# EasyEDA Pro project wifi-power.eprj

# Schematic Schematic

## Sheets
1 P1: Board Name: Board; Create Date: 2025-02-23; Page Name: P1; Project Name: wifi-power; Schematic Name: Schematic; Update Date: 2025-02-23; Company: https://github.com/NimaLTD/wifi-power; Page Size: A4; Version: V1.0
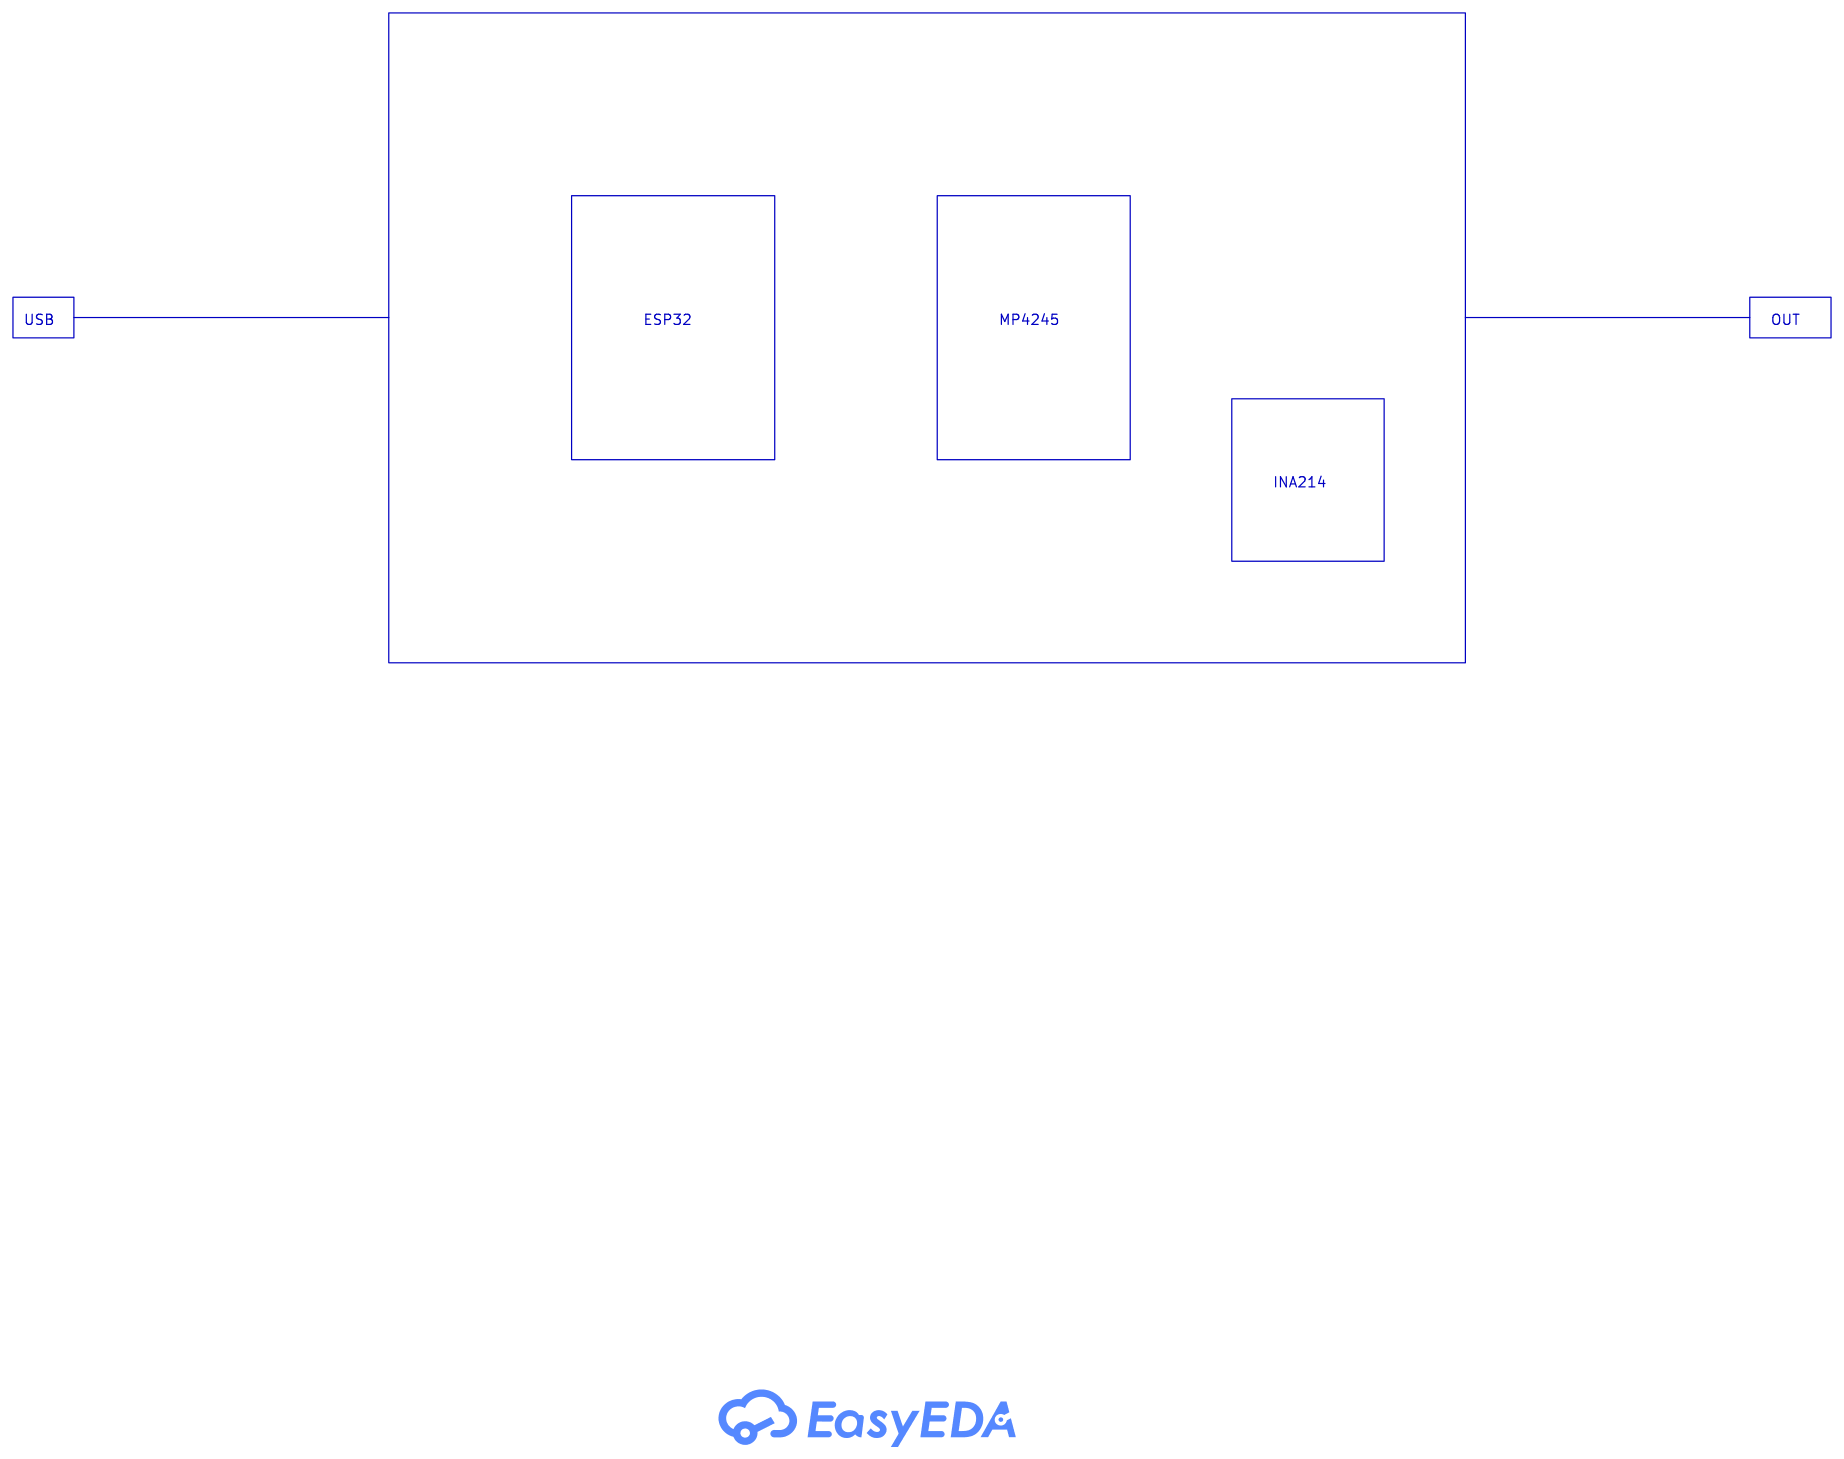
[diagram p0: P1]
2 USB: Page Name: USB; Update Date: 2025-02-25; Company: EasyEDA.com
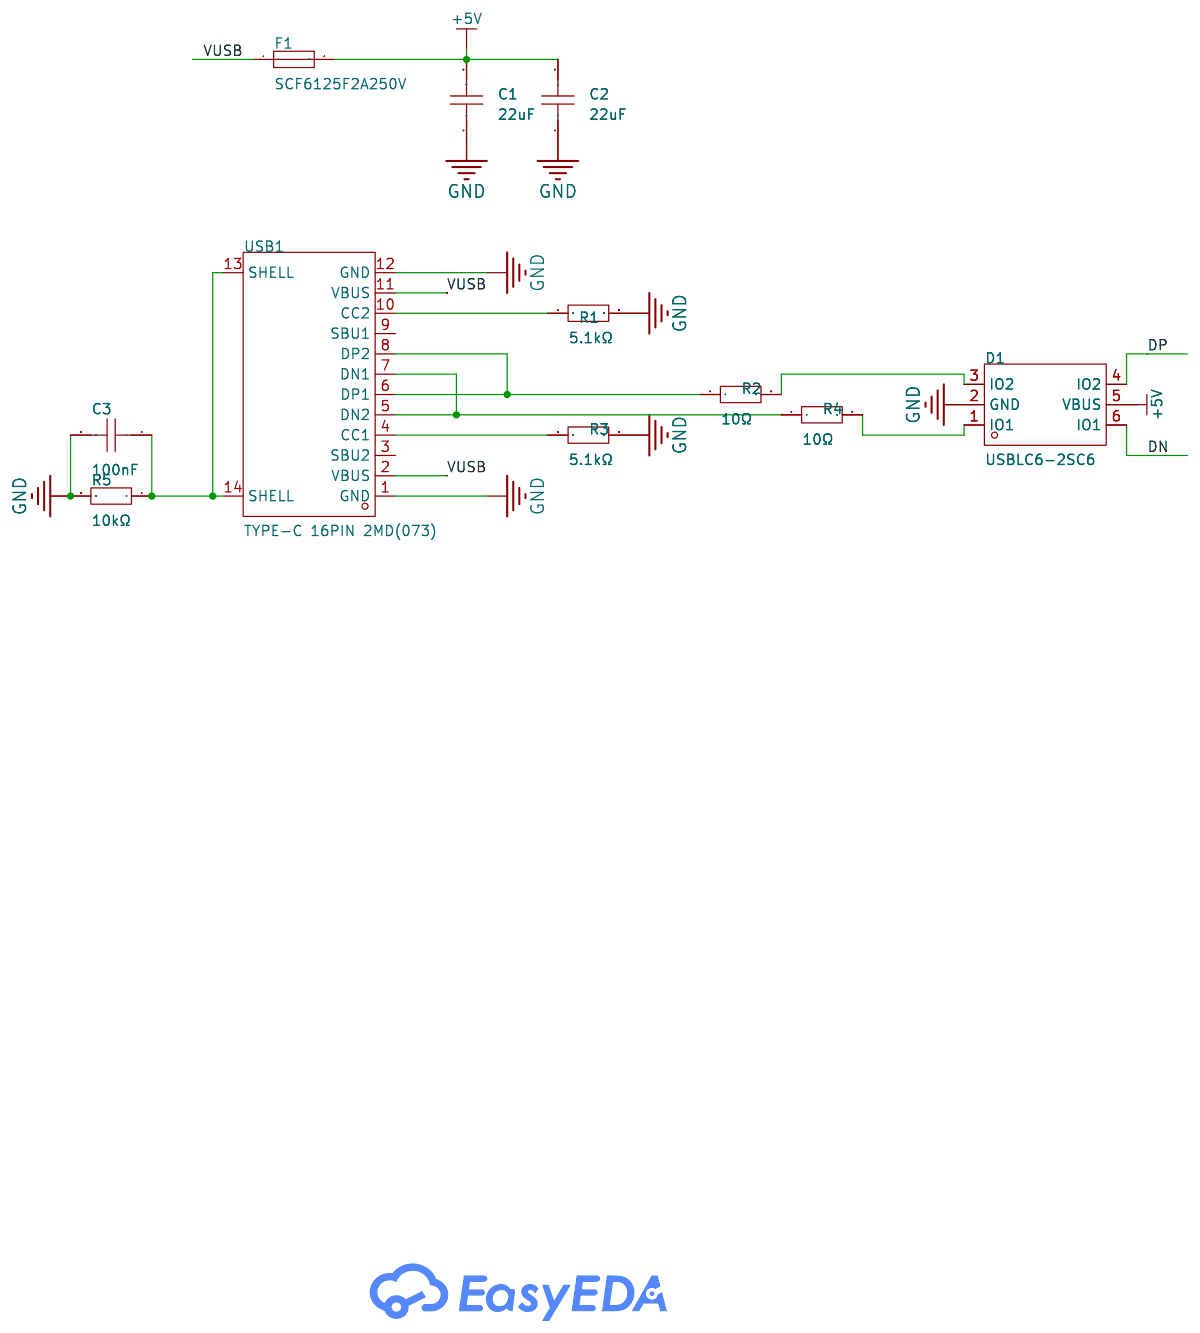
[diagram p1: USB]
3 REG: Page Name: REG; Company: EasyEDA.com
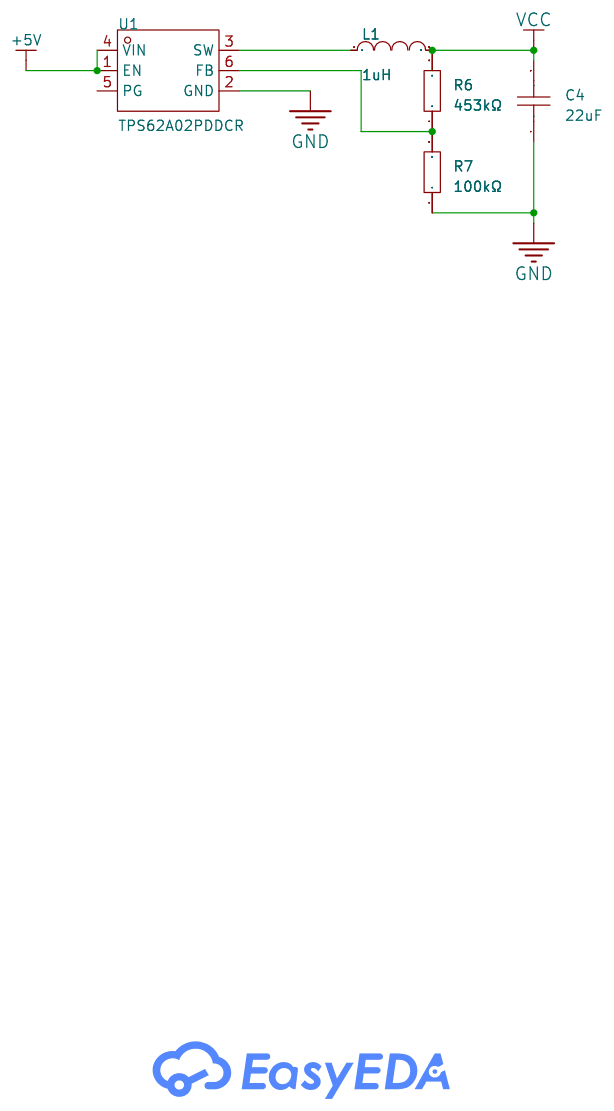
[diagram p2: REG]
4 ESP32: Page Name: ESP32; Update Date: 2025-02-25; Company: EasyEDA.com
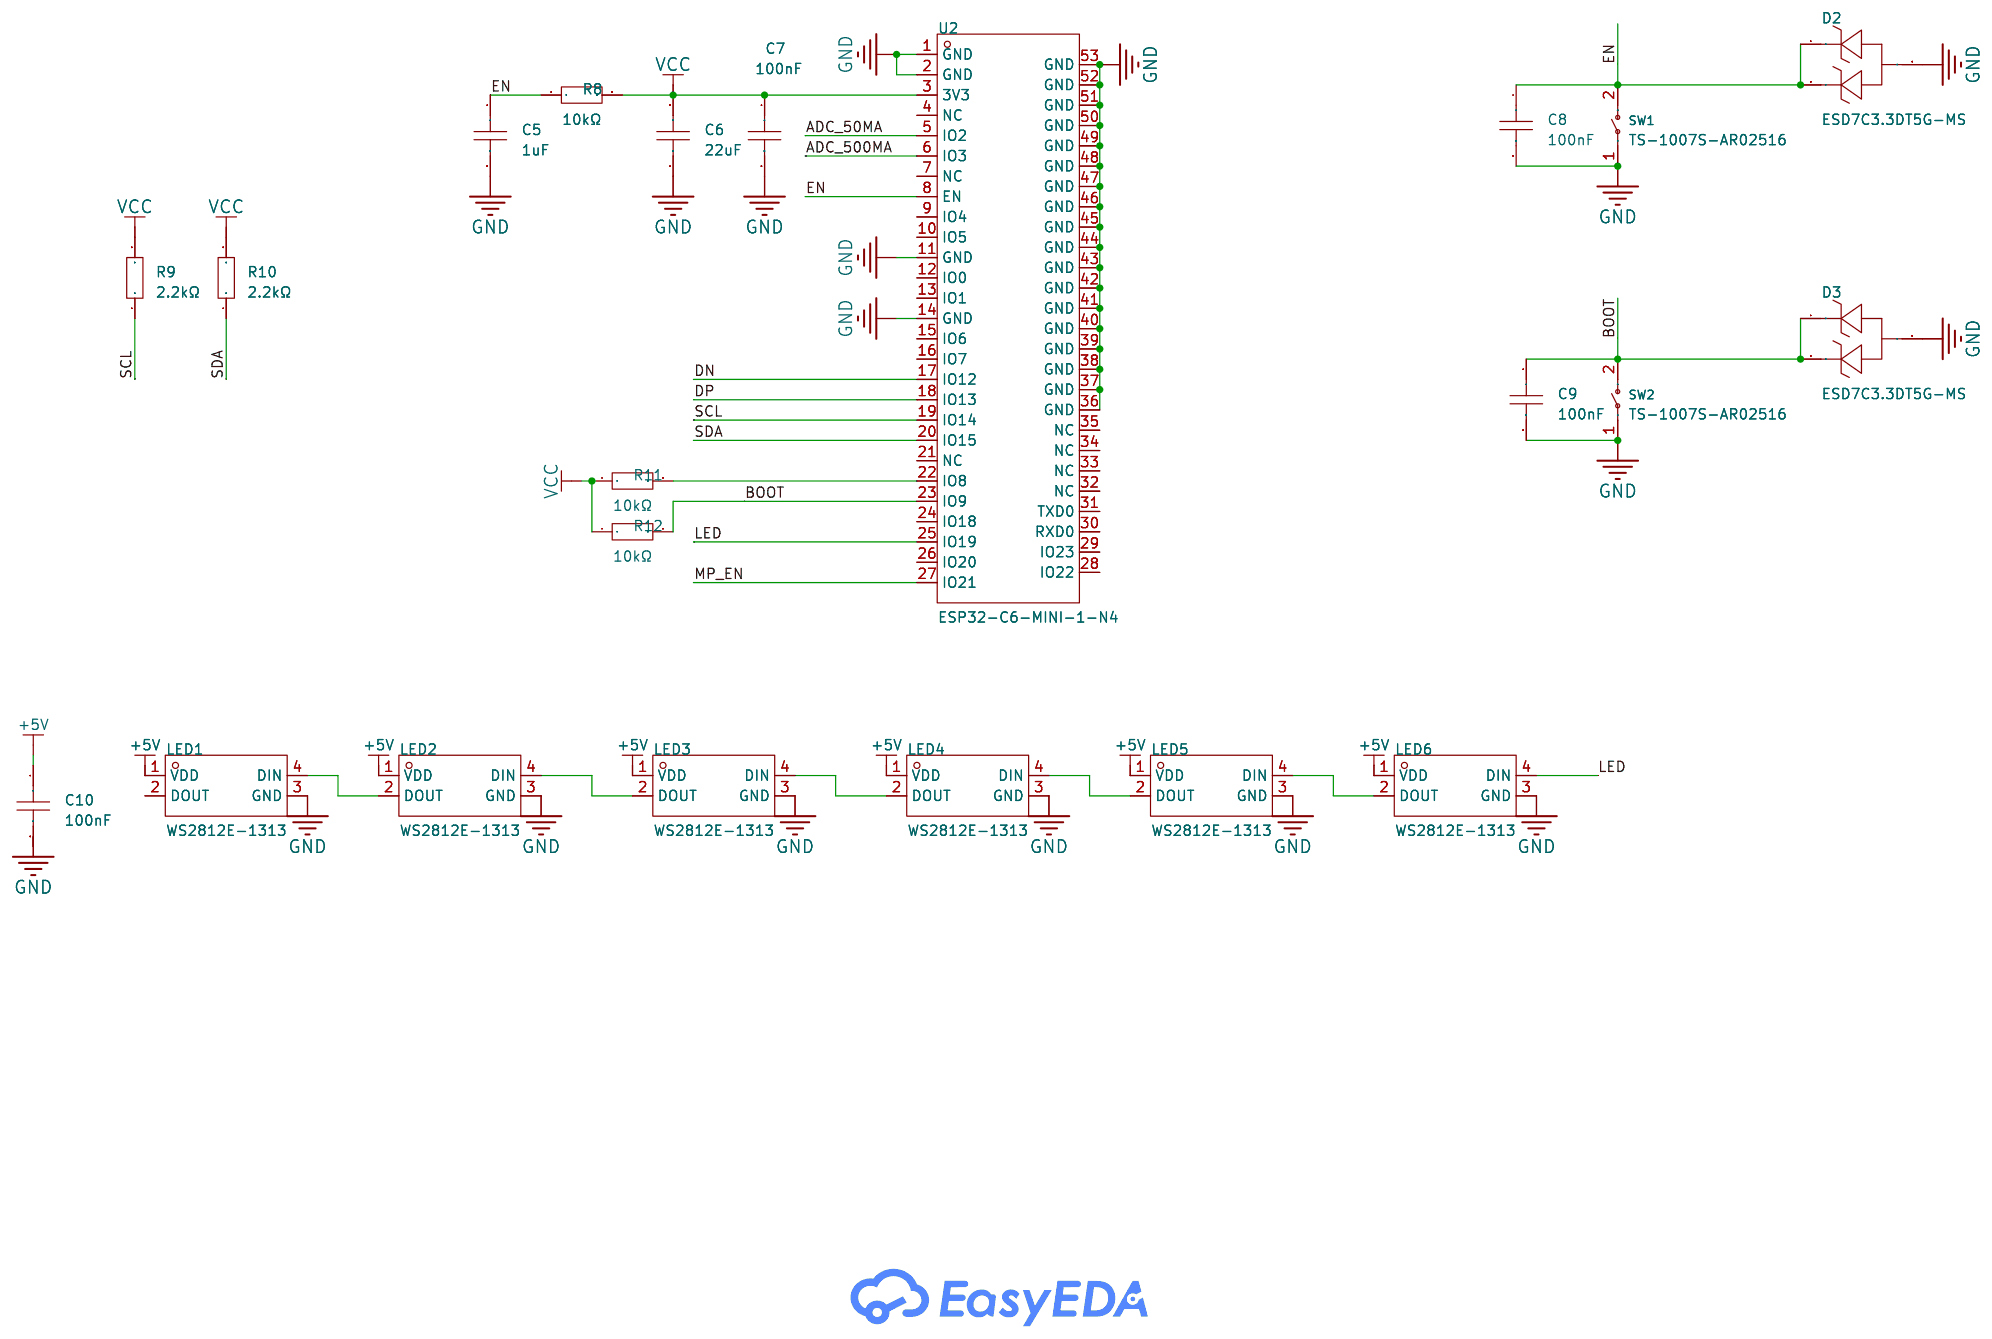
[diagram p3: ESP32]
5 MP4245: Page Name: MP4245; Update Date: 2025-02-25; Company: EasyEDA.com
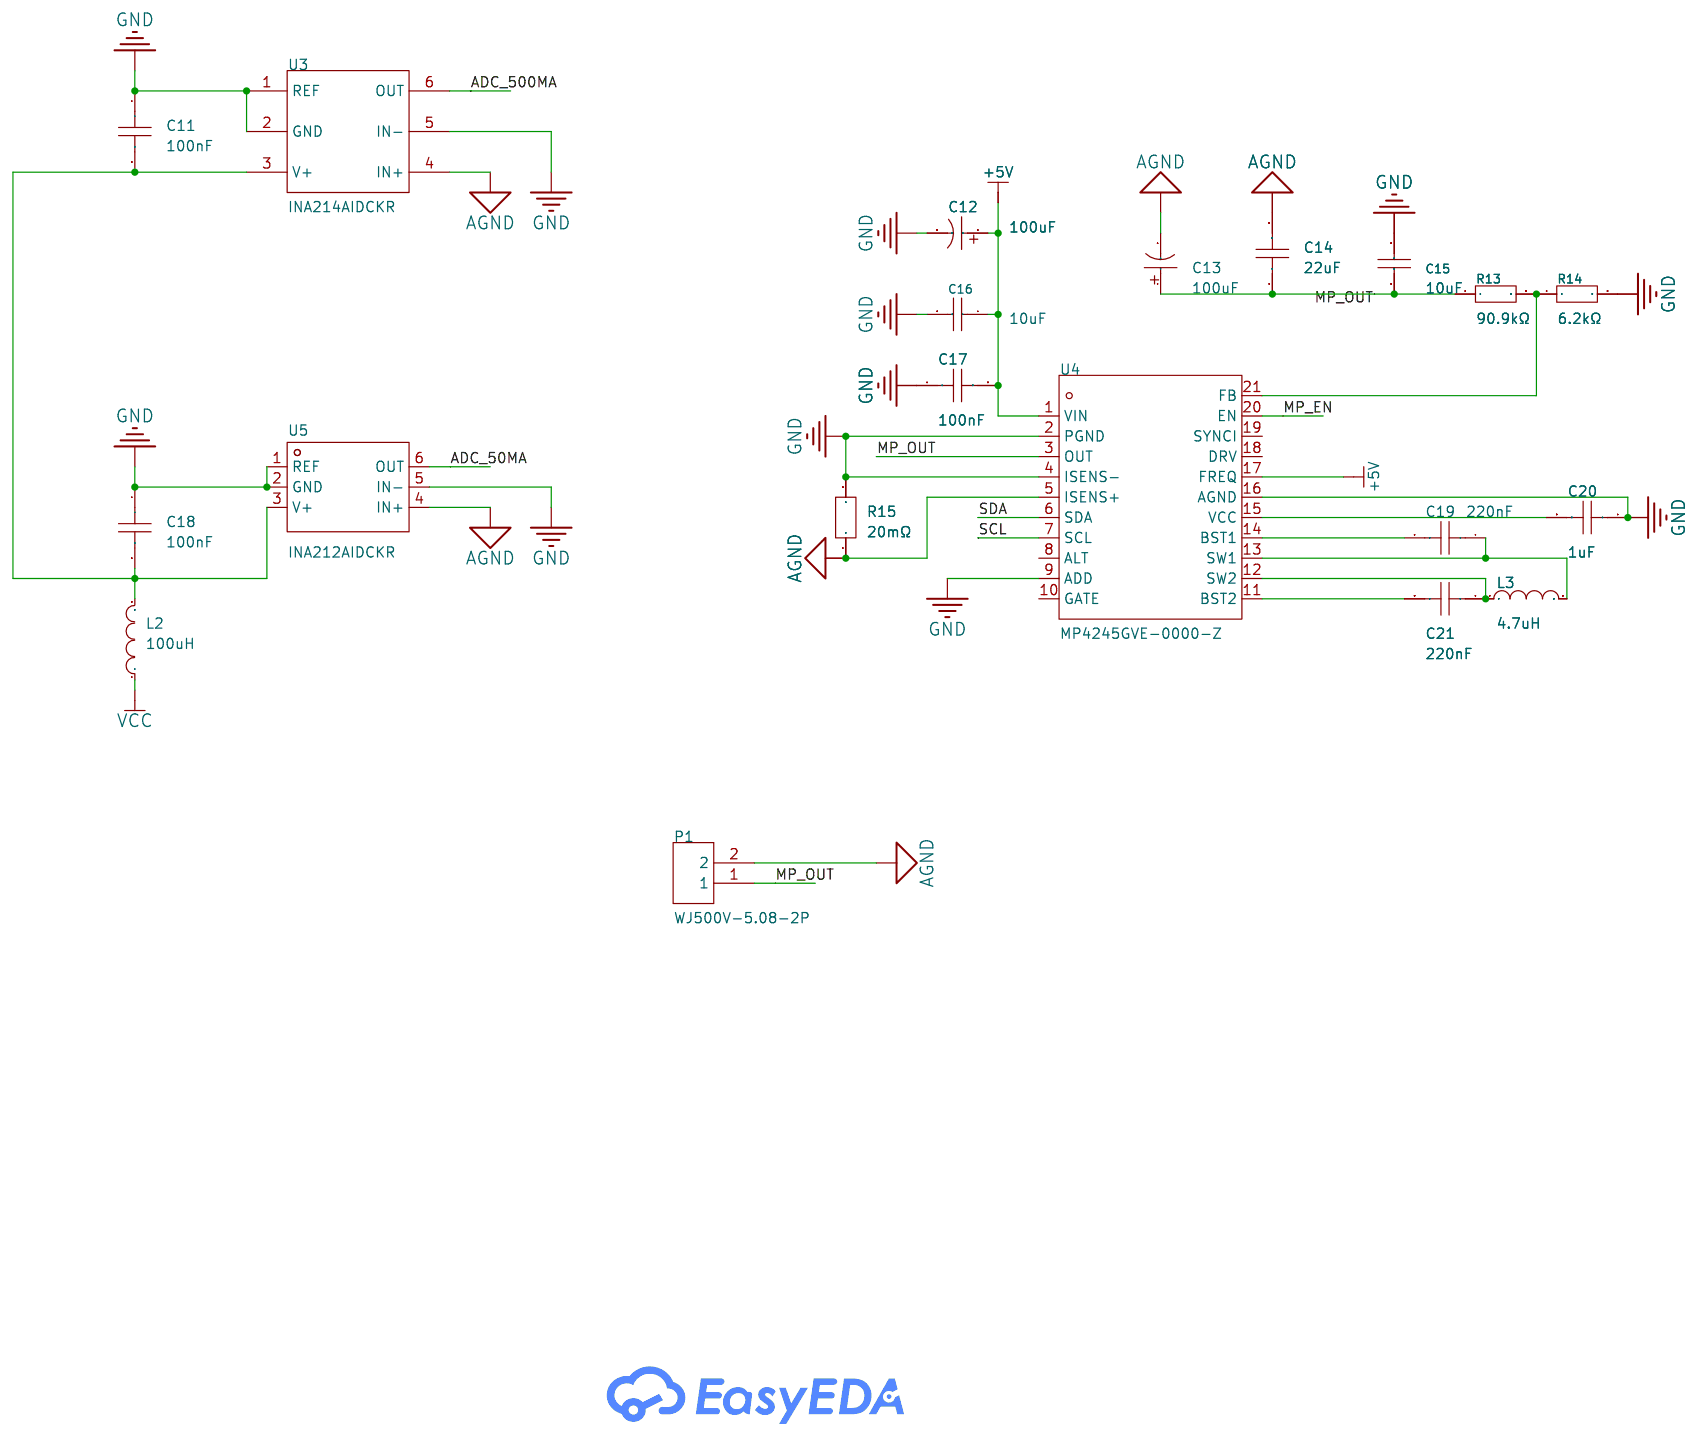
[diagram p4: MP4245]

## Parts
sheet ESP32
C5  1uF  [C0603]
C6  22uF  [C0805]
C7  100nF  [C0603]
C8  100nF  [C0603]
C9  100nF  [C0603]
C10  100nF  [C0603]
D2  ESD7C3.3DT5G-MS  [SOT-723-3_L1.2-W0.8-P0.80-LS1.2-BR]
D3  ESD7C3.3DT5G-MS  [SOT-723-3_L1.2-W0.8-P0.80-LS1.2-BR]
LED1  WS2812E-1313  [LED-SMD_4P-L1.3-W1.3-P0.80_WS2812E-1313]
LED2  WS2812E-1313  [LED-SMD_4P-L1.3-W1.3-P0.80_WS2812E-1313]
LED3  WS2812E-1313  [LED-SMD_4P-L1.3-W1.3-P0.80_WS2812E-1313]
LED4  WS2812E-1313  [LED-SMD_4P-L1.3-W1.3-P0.80_WS2812E-1313]
LED5  WS2812E-1313  [LED-SMD_4P-L1.3-W1.3-P0.80_WS2812E-1313]
LED6  WS2812E-1313  [LED-SMD_4P-L1.3-W1.3-P0.80_WS2812E-1313]
R8  10kΩ  [R0603]
R9  2.2kΩ  [R0603]
R10  2.2kΩ  [R0603]
R11  10kΩ  [R0603]
R12  10kΩ  [R0603]
SW1  TS-1007S-AR02516  [SW-SMD_L6.1-W3.6-LS7.9]
SW2  TS-1007S-AR02516  [SW-SMD_L6.1-W3.6-LS7.9]
U2  ESP32-C6-MINI-1-N4  [WIFIM-SMD_61P-L16.6-W13.2-P0.80-ESP32-C6-MINI-1-N4]
sheet MP4245
C11  100nF  [C0603]
C12  100uF  [CAP-SMD_BD6.3-L6.6-W6.6-FD]
C13  100uF  [CAP-SMD_BD6.3-L6.6-W6.6-FD]
C14  22uF  [C1206]
C15  10uF  [C0805]
C16  10uF  [C0805]
C17  100nF  [C0603]
C18  100nF  [C0603]
C19  220nF  [C0603]
C20  1uF  [C0603]
C21  220nF  [C0603]
L2  100uH  [L0805]
L3  4.7uH  [IND-SMD_L5.7-W5.2_CYA0530]
P1  WJ500V-5.08-2P  [CONN-TH_2P-P5.00_WJ500V-5.08-2P]
R13  90.9kΩ  [R0603]
R14  6.2kΩ  [R0603]
R15  20mΩ  [R0805]
U3  INA214AIDCKR  [SC-70-6_L2.2-W1.3-P0.65-LS2.2-BR]
U4  MP4245GVE-0000-Z  [QFN-21_L5.0-W4.0_MP4245GVE]
U5  INA212AIDCKR  [SOT-363_L2.0-W1.3-P0.65-LS2.1-BL]
sheet REG
C4  22uF  [C0805]
L1  1uH  [L0806]
R6  453kΩ  [R0603]
R7  100kΩ  [R0603]
U1  TPS62A02PDDCR  [SOT-23-6_L2.9-W1.6-P0.95-LS2.9-BL]
sheet USB
C1  22uF  [C0805]
C2  22uF  [C0805]
C3  100nF  [C0603]
D1  USBLC6-2SC6  [SOT-23-6_L2.9-W1.6-P0.95-LS2.8-BL]
F1  SCF6125F2A250V  [FUSE-SMD_L6.3-W2.7]
R1  5.1kΩ  [R0603]
R2  10Ω  [R0603]
R3  5.1kΩ  [R0603]
R4  10Ω  [R0603]
R5  10kΩ  [R0603]
USB1  TYPE-C 16PIN 2MD(073)  [USB-C-SMD_TYPE-C-6PIN-2MD-073]

## Library data of the parts
C5 = 0603F105Z100CT: Capacitance: Tolerance:-20%~+80% Tolerance:-20%~+80% Voltage Rated: Temperature Coefficient:; LCSC Part Name: 1uF -20%~+80% 10V; Supplier Part: C302042; Manufacturer: Walsin(华新科); Supplier Footprint: 0603; JLCPCB Part Class: Extended Part; Datasheet: https://atta.szlcsc.com/upload/public/pdf/source/20191217/C469650_84AD5C6F618CF4AC0C6D987F2E8FE6F8.pdf; Supplier: LCSC; Tolerance: -20%~+80%
C1 C2 C4 C6 = CL21A226MAYNNNE: Capacitance: Tolerance:±20% Tolerance:±20% Voltage Rated: Temperature Coefficient:; LCSC Part Name: 22uF ±20% 25V; Supplier Part: C602037; Manufacturer: SAMSUNG(三星); Supplier Footprint: 0805; JLCPCB Part Class: Extended Part; Datasheet: https://atta.szlcsc.com/upload/public/pdf/source/20200609/C602037_1A0D619693E608A1BF6E80154254E2DB.pdf; Supplier: LCSC; Tolerance: ±20%
C3 C7-C11 C17 C18 = CC0603KRX7R9BB104: Capacitance: Tolerance:±10% Tolerance:±10% Voltage Rated: Temperature Coefficient:; LCSC Part Name: 100nF ±10% 50V; Supplier Part: C14663; Manufacturer: YAGEO(国巨); Supplier Footprint: 0603; JLCPCB Part Class: Basic Part; Datasheet: https://atta.szlcsc.com/upload/public/pdf/source/20180910/C282072_33301C7F631E79921B82A8DAC6BCC5B3.pdf; Supplier: LCSC; Tolerance: ±10%
D2 D3 = ESD7C3.3DT5G-MS: Reverse Stand-Off Voltage (Vrwm):3.3V Maximum Clamping Voltage:3.3V Peak Pulse Current (Ipp)@10/1000us:1.5A Peak Pulse Power Dissipation (Ppp)@10/1000us:1.5W@8/20us Breakdown Voltage:5V Reverse Leakage Current (Ir):1uA Type:TVS; LCSC Part Name: VRWM:3.3V 12PF IPP:1.5A; Supplier Part: C5331072; Manufacturer: MSKSEMI(美森科); Supplier Footprint: SOT-723; JLCPCB Part Class: Extended Part; Datasheet: https://atta.szlcsc.com/upload/public/pdf/source/20230214/ABD9F9A5D2445E53945459E67CFD645D.pdf; Supplier: LCSC; Reverse Stand-Off Voltage (Vrwm): 3.3V; Maximum Clamping Voltage: 3.3V; Peak Pulse Current (Ipp)@10/1000us: 1.5A; Peak Pulse Power Dissipation (Ppp)@10/1000us: 1.5W@8/20us; Breakdown Voltage: 5V; Reverse Leakage Current (Ir): 1uA; Type: TVS
LED1-LED6 = WS2812E-1313: Supplier Part: C5446700; Manufacturer: worldsemi; Supplier Footprint: SMD1313; JLCPCB Part Class: Extended Part; Datasheet: https://atta.szlcsc.com/upload/public/pdf/source/20240229/B8051D75F82007E6B8E5AD9424D7210B.pdf; Supplier: LCSC
R5 R8 R11 R12 = FRC0603J103TS: Type:Thick Film Resistors Resistance:10kΩ Tolerance:±5% Tolerance:±5% Power(Watts): Overload Voltage (Max): Temperature Coefficient:±100ppm/℃ Temperature Coefficient:±100ppm/℃ Operating Temperature Range:-55℃~+155℃ Operating Temperature Range:-55℃~+155℃; LCSC Part Name: 10kΩ ±5% 100mW 厚膜电阻; Supplier Part: C2930027; Manufacturer: FOJAN(富捷); Supplier Footprint: 0603; JLCPCB Part Class: Extended Part; Datasheet: https://atta.szlcsc.com/upload/public/pdf/source/20211221/925EC7D7225764EE0046F22065062C87.pdf; Supplier: LCSC; Type: Thick Film Resistors; Tolerance: ±5%; Temperature Coefficient: ±100ppm/℃; Operating Temperature Range: -55℃~+155℃
R9 R10 = FRC0603J222 TS: Type:Thick Film Resistors Resistance:2.2kΩ Tolerance:±5% Tolerance:±5% Power(Watts): Overload Voltage (Max): Temperature Coefficient:±100ppm/℃ Temperature Coefficient:±100ppm/℃ Operating Temperature Range:-55℃~+155℃ Operating Temperature Range:-55℃~+155℃; LCSC Part Name: 2.2kΩ ±5% 100mW 厚膜电阻; Supplier Part: C2907117; Manufacturer: FOJAN(富捷); Supplier Footprint: 0603; JLCPCB Part Class: Extended Part; Datasheet: https://atta.szlcsc.com/upload/public/pdf/source/20211221/925EC7D7225764EE0046F22065062C87.pdf; Supplier: LCSC; Type: Thick Film Resistors; Tolerance: ±5%; Temperature Coefficient: ±100ppm/℃; Operating Temperature Range: -55℃~+155℃
SW1 SW2 = TS-1007S-AR02516: Circuit:SPST Actuator Style:Rectangle button Operating Force:160gf Mounting Style:Brick nogging Switch Length:6.1mm Switch Width:3.7mm Switch Height:2.5mm Strike Gundam:不带 Contact Current:50mA Voltage Rating (DC):12V Insulation Resistance:100MΩ Actuator/C; LCSC Part Name: 6.1*3.7*2.5mm 立贴 轻触开关; Supplier Part: C720381; Manufacturer: XUNPU(讯普); Supplier Footprint: SMD; JLCPCB Part Class: Extended Part; Datasheet: https://atta.szlcsc.com/upload/public/pdf/source/20200812/C720381_7D5C1A68D18F0196EF37FF8AC1146778.pdf; Supplier: LCSC; Circuit: SPST; Actuator Style: Rectangle button; Operating Force: 160gf; Mounting Style: Brick nogging; Switch Length: 6.1mm; Switch Width: 3.7mm; Switch Height: 2.5mm; Strike Gundam: 不带; Contact Current: 50mA; Voltage Rating (DC): 12V; Insulation Resistance: 100MΩ; Actuator/Cap Color: Gray; Pin Style: Gull Wing; Mechanical Life: 5万次; Operating Temperature: -30℃~+80℃
U2 = ESP32-C6-MINI-1-N4: Supplier Part: C5736265; Manufacturer: ESPRESSIF(乐鑫); Supplier Footprint: SMD-53P; JLCPCB Part Class: Extended Part; Datasheet: https://atta.szlcsc.com/upload/public/pdf/source/20240130/4529D418EFEC832950EB8101798FAED6.pdf; Supplier: LCSC
C12 C13 = UWX1C101MCL1GB: Capacitance: Tolerance:±20% Tolerance:±20% Voltage Rated: Ripple Current:129mA@10kHz Equivalent Series Resistance(ESR):- Diameter:- Height - Seated (Max):- Lifetime @ Temp:2000hrs@85℃ Operating Temperature:-40℃~+85℃ Operating Temperature:-40℃~+85℃; LCSC Part Name: 100uF ±20% 16V 停产; Supplier Part: C111600; Manufacturer: Nichicon(尼吉康); Supplier Footprint: SMD,D6.3xL5.4mm; JLCPCB Part Class: Extended Part; Datasheet: https://atta.szlcsc.com/upload/public/pdf/source/20170511/1494500117761.pdf; Supplier: LCSC; Tolerance: ±20%; Ripple Current: 129mA@10kHz; Lifetime @ Temp: 2000hrs@85℃; Operating Temperature: -40℃~+85℃
C14 = CL31A226KOHNNNE: Capacitance: Tolerance:±10% Tolerance:±10% Voltage Rated: Temperature Coefficient:; LCSC Part Name: 22uF ±10% 16V; Supplier Part: C90146; Manufacturer: SAMSUNG(三星); Supplier Footprint: 1206; JLCPCB Part Class: Extended Part; Datasheet: https://atta.szlcsc.com/upload/public/pdf/source/20161228/1482890861309.pdf; Supplier: LCSC; Tolerance: ±10%
C15 C16 = CL21A106KOQNNNE: Capacitance: Tolerance:±10% Tolerance:±10% Voltage Rated: Temperature Coefficient:; LCSC Part Name: 10uF ±10% 16V; Supplier Part: C602037; Manufacturer: SAMSUNG(三星); Supplier Footprint: 0805; JLCPCB Part Class: Extended Part; Datasheet: https://atta.szlcsc.com/upload/public/pdf/source/20160218/1457707763339.pdf; Supplier: LCSC; Tolerance: ±10%
C19-C21 = CAP_0603: Supplier Footprint: 0603; Supplier Part: C15849
L2 = EBLS201212-101K: Inductance: Tolerance:±10% Tolerance:±10% Rated Current:- Saturation Current (Isat):- DC Resistance (DCR):- Q @ Freq:- Frequency - Self Resonant:- Ratings:; LCSC Part Name: 100uH ±10%; Supplier Part: C963815; Manufacturer: HYHONGYEX(宏业); Supplier Footprint: 0805; JLCPCB Part Class: Extended Part; Datasheet: https://atta.szlcsc.com/upload/public/pdf/source/20220506/4E92C8865609F42FBF1DE4ACE5505438.pdf; Supplier: LCSC; Tolerance: ±10%
L3 = CYA0530-4.7UH: Inductance: Tolerance:±20% Tolerance:±20% Current Rating: DC Resistance(DCR):; LCSC Part Name: 4.7uH ±20%; Supplier Part: C19274364; Manufacturer: SHOU HAN(首韩); Supplier Footprint: SMD,5.7x5.2mm; JLCPCB Part Class: Extended Part; Datasheet: https://atta.szlcsc.com/upload/public/pdf/source/20250110/CD4AA2A279DDCED95C1E7A548E0DACCA.pdf; Supplier: LCSC; Tolerance: ±20%
P1 = WJ500V-5.08-2P: Structure:1x2P Pitch:5.08mm Color:Green Mounting Style:Direct Insert Current Rating (Max):18A Voltage Rating (Max):250V Number of Pins:2P Number of Rows:1 Wire Gauge - AWG:14~30 Wire Gauge - AWG:14~30 Wire Gauge - mm2:2.5 Wire Gauge - mm2:2.5 Number of PI; LCSC Part Name: 1x2P 5.08mm 直插 排数:1 每排P数:2; Supplier Part: C8465; Manufacturer: KANGNEX(康奈克斯电气); Supplier Footprint: 插件,P=5.08mm; JLCPCB Part Class: Extended Part; Datasheet: https://atta.szlcsc.com/upload/public/pdf/source/20191225/C8465_02D34CE5B5B4A53DF5891601D97FA9F4.pdf; Supplier: LCSC; Structure: 1x2P; Pitch: 5.08mm; Color: Green; Mounting Style: Direct Insert; Current Rating (Max): 18A; Voltage Rating (Max): 250V; Number of Pins: 2P; Number of Rows: 1; Wire Gauge - AWG: 14~30; Wire Gauge - mm2: 2.5; Number of PINs Per Row: 2; Operating Temperature Range: -40℃~+105℃; Screw Specification: M2.5
R13 = RMC060390.9K1%N: Resistance: Tolerance:±1% Tolerance:±1% Power(Watts):; LCSC Part Name: 90.9kΩ ±1% 100mW; Supplier Part: C25803; Manufacturer: Tyohm(幸亚电阻); Supplier Footprint: 0603; JLCPCB Part Class: Extended Part; Datasheet: https://atta.szlcsc.com/upload/public/pdf/source/20190115/C325956_D27151D492FFB3C9AB4A6F14FE01F30A.pdf; Supplier: LCSC; Tolerance: ±1%
R14 = RMC06036.2K1%N: Resistance: Tolerance:±1% Tolerance:±1% Power(Watts):; LCSC Part Name: 6.2kΩ ±1% 100mW; Supplier Part: C25803; Manufacturer: Tyohm(幸亚电阻); Supplier Footprint: 0603; JLCPCB Part Class: Extended Part; Datasheet: https://atta.szlcsc.com/upload/public/pdf/source/20190115/C325956_D27151D492FFB3C9AB4A6F14FE01F30A.pdf; Supplier: LCSC; Tolerance: ±1%
R15 = FCF05FT-R020E: Resistance: Tolerance:±1% Tolerance:±1% Power(Watts):; LCSC Part Name: 20mΩ ±1% 250mW; Supplier Part: C5381532; Manufacturer: PSA(信昌电陶); Supplier Footprint: 0805; JLCPCB Part Class: Extended Part; Datasheet: https://atta.szlcsc.com/upload/public/pdf/source/20230323/9A18D1C4BED681258F673975E260EC5A.pdf; Supplier: LCSC; Tolerance: ±1%
U3 = INA214AIDCKR: Number of Channels:Single channel Supply Current:65uA Operating Temperature:-40℃~+125℃ Operating Temperature:-40℃~+125℃; Supplier Part: C105240; Manufacturer: TI(德州仪器); Supplier Footprint: SOT-363(SC-70-6); JLCPCB Part Class: Extended Part; Datasheet: https://www.ti.com/cn/lit/gpn/ina214; Supplier: LCSC; Number of Channels: Single channel; Supply Current: 65uA; Operating Temperature: -40℃~+125℃
U4 = MP4245GVE-0000-Z: Supplier Part: C20099557; Manufacturer: MPS(芯源); Supplier Footprint: QFN-21(4x5); JLCPCB Part Class: Extended Part; Datasheet: https://atta.szlcsc.com/upload/public/pdf/source/20240130/6B1941436C934263D2955E8089DB3BBC.pdf; Supplier: LCSC
U5 = INA212AIDCKR: Number of Channels:Single channel Supply Current:65uA Operating Temperature:-40℃~+125℃ Operating Temperature:-40℃~+125℃; LCSC Part Name: 电压输出、低侧或高侧测量、双向、零漂移分流监控器; Supplier Part: C128622; Manufacturer: TI(德州仪器); Supplier Footprint: SOT-363-6; JLCPCB Part Class: Extended Part; Datasheet: https://www.ti.com/cn/lit/gpn/ina212; Supplier: LCSC; Number of Channels: Single channel; Supply Current: 65uA; Operating Temperature: -40℃~+125℃
L1 = DFE201610E-1R0M=P2: Inductance: Tolerance:±20% Tolerance:±20% Rated Current: Saturation Current (Isat):3.6A DC Resistance (DCR): Q @ Freq:- Frequency - Self Resonant:- Ratings:; LCSC Part Name: 1uH ±20% 3.6A; Supplier Part: C161082; Manufacturer: muRata(村田); Supplier Footprint: 0806; JLCPCB Part Class: Extended Part; Datasheet: https://atta.szlcsc.com/upload/public/pdf/source/20180329/C161082_B32C8834554668ECFD54206075068FE7.pdf; Supplier: LCSC; Tolerance: ±20%; Saturation Current (Isat): 3.6A
R6 = 0603WAF4533T5E: Type:Thick Film Resistors Resistance:453kΩ Tolerance:±1% Tolerance:±1% Power(Watts): Overload Voltage (Max): Temperature Coefficient:±100ppm/℃ Temperature Coefficient:±100ppm/℃ Operating Temperature Range:-55℃~+155℃ Operating Temperature Range:-55℃~+155℃; LCSC Part Name: 453kΩ ±1% 100mW 厚膜电阻; Supplier Part: C25818; Manufacturer: UNI-ROYAL(厚声); Supplier Footprint: 0603; JLCPCB Part Class: Extended Part; Datasheet: https://atta.szlcsc.com/upload/public/pdf/source/20200306/C422600_1E6D84923E4A46A82E41ADD87F860B5C.pdf; Supplier: LCSC; Type: Thick Film Resistors; Tolerance: ±1%; Temperature Coefficient: ±100ppm/℃; Operating Temperature Range: -55℃~+155℃
R7 = RC0603FR-07100KL: Type:Thick Film Resistors Resistance: Tolerance:±1% Tolerance:±1% Power(Watts): Overload Voltage (Max): Temperature Coefficient:±100ppm/℃ Temperature Coefficient:±100ppm/℃ Operating Temperature Range:-55℃~+155℃ Operating Temperature Range:-55℃~+155℃; LCSC Part Name: 厚膜电阻 100kΩ ±1% 100mW; Supplier Part: C14675; Manufacturer: YAGEO(国巨); Supplier Footprint: 0603; JLCPCB Part Class: Extended Part; Datasheet: https://atta.szlcsc.com/upload/public/pdf/source/20140324/1457707028752.pdf; Supplier: LCSC; Type: Thick Film Resistors; Tolerance: ±1%; Temperature Coefficient: ±100ppm/℃; Operating Temperature Range: -55℃~+155℃
U1 = TPS62A02PDDCR: LCSC Part Name: 高效同步降压转换器; Supplier Part: C22445521; Manufacturer: TI(德州仪器); Supplier Footprint: SOT-23-THIN-6; JLCPCB Part Class: Extended Part; Supplier: LCSC
D1 = USBLC6-2SC6_C2827654: polarity:Unidirectional Reverse Stand-Off Voltage (Vrwm):5V Maximum Clamping Voltage:12V Peak Pulse Current (Ipp):6A Peak Pulse Power Dissipation (Ppp):150W Breakdown Voltage:6V Reverse Leakage Current (Ir):80nA Number of Lines:Dual channel Operating Temp; LCSC Part Name: ESD，可防30kV静电; Supplier Part: C2827654; Manufacturer: TECH PUBLIC(台舟); Supplier Footprint: SOT-23-6; JLCPCB Part Class: Extended Part; Datasheet: https://atta.szlcsc.com/upload/public/pdf/source/20210810/FBD75DE717D6D97BAC6DD7F2B5C09DCD.pdf; Supplier: LCSC; polarity: Unidirectional; Reverse Stand-Off Voltage (Vrwm): 5V; Maximum Clamping Voltage: 12V; Peak Pulse Current (Ipp): 6A; Peak Pulse Power Dissipation (Ppp): 150W; Breakdown Voltage: 6V; Reverse Leakage Current (Ir): 80nA; Number of Lines: Dual channel; Operating Temperature: -55℃~+125℃; level of protection: IEC 61000-4-2; Type: ESD
F1 = SCF6125F2A250V: Current Rating: Rated Voltage(DC): Features: Rated voltage AC:- size:- Rated voltage:250V Breaking ability:- Fusing characteristics:Quick Break working temperature:-55°C-125°C series:SCF6125; LCSC Part Name: SET(赛尔特) SMD贴片保险丝 SCT6125 2A 250V/125V 快断 1个; Supplier Part: C19712554; Manufacturer: SET(赛尔特); Supplier Footprint: SMD,6.3x2.7mm; JLCPCB Part Class: Extended Part; Datasheet: https://atta.szlcsc.com/upload/public/pdf/source/20231218/EDA2EA968C71574806DD66305FE21925.pdf; Supplier: LCSC; Rated voltage: 250V; Fusing characteristics: Quick Break; working temperature: -55°C-125°C; series: SCF6125
R1 R3 = FRC0603J512 TS: Type:Thick Film Resistors Resistance:5.1kΩ Tolerance:±5% Tolerance:±5% Power(Watts): Overload Voltage (Max): Temperature Coefficient:±100ppm/℃ Temperature Coefficient:±100ppm/℃ Operating Temperature Range:-55℃~+155℃ Operating Temperature Range:-55℃~+155℃; LCSC Part Name: 5.1kΩ ±5% 100mW 厚膜电阻; Supplier Part: C2907114; Manufacturer: FOJAN(富捷); Supplier Footprint: 0603; JLCPCB Part Class: Extended Part; Datasheet: https://atta.szlcsc.com/upload/public/pdf/source/20211221/925EC7D7225764EE0046F22065062C87.pdf; Supplier: LCSC; Type: Thick Film Resistors; Tolerance: ±5%; Temperature Coefficient: ±100ppm/℃; Operating Temperature Range: -55℃~+155℃
R2 R4 = 0603WAF100JT5E: Type:Thick Film Resistors Resistance:10Ω Tolerance:±1% Tolerance:±1% Power(Watts): Overload Voltage (Max): Temperature Coefficient:±400ppm/℃ Temperature Coefficient:±400ppm/℃ Operating Temperature Range:-55℃~+155℃ Operating Temperature Range:-55℃~+155℃; LCSC Part Name: 10Ω ±1% 100mW 厚膜电阻; Supplier Part: C22859; Manufacturer: UNI-ROYAL(厚声); Supplier Footprint: 0603; JLCPCB Part Class: Basic Part; Datasheet: https://atta.szlcsc.com/upload/public/pdf/source/20200306/C422600_1E6D84923E4A46A82E41ADD87F860B5C.pdf; Supplier: LCSC; Type: Thick Film Resistors; Tolerance: ±1%; Temperature Coefficient: ±400ppm/℃; Operating Temperature Range: -55℃~+155℃
USB1 = TYPE-C 16PIN 2MD(073): Connector Type:Type-C Standard:USB 3.1 Gender:Female Mounting Style:Horizontal attachment Number of Contacts:16P Number of Ports:1 Current Rating - Power (Max):5A Operating Temperature Range:-25℃~+85℃ Operating Temperature Range:-25℃~+85℃ Rated Voltage (M; LCSC Part Name: Type-C 母 卧贴; Supplier Part: C2765186; Manufacturer: SHOU HAN(首韩); Supplier Footprint: SMD; JLCPCB Part Class: Extended Part; Datasheet: https://atta.szlcsc.com/upload/public/pdf/source/20211123/39B17C16241EAC15C5E277BDA434118E.pdf; Supplier: LCSC; Connector Type: Type-C; Standard: USB 3.1; Gender: Female; Mounting Style: Horizontal attachment; Number of Contacts: 16P; Number of Ports: 1; Current Rating - Power (Max): 5A; Operating Temperature Range: -25℃~+85℃; Rated Voltage (Max): 5V; Connect-Disconnect Life: 5000 Cuts; Core Colour: Black

## Nets
+5V: C1.2 C2.2 C10.1 C12.1 C16.1 C17.2 D1.5(VBUS) F1.2 LED1.1(VDD) LED2.1(VDD) LED3.1(VDD) LED4.1(VDD) LED5.1(VDD) LED6.1(VDD) U1.1(EN) U1.4(VIN) U4.1(VIN) U4.17(FREQ)
AGND: C13.2 C14.2 P1.2 R15.1 U3.4(IN+) U4.5(ISENS+) U5.4(IN+)
GND: C1.1 C2.1 C3.2 C4.1 C5.2 C6.1 C7.2 C8.2 C9.2 C10.2 C11.1 C12.2 C15.2 C16.2 C17.1 C18.1 C20.1 D1.2(GND) D2.3(A) D3.3(A) LED1.3(GND) LED2.3(GND) LED3.3(GND) LED4.3(GND) LED5.3(GND) LED6.3(GND) R1.2 R3.2 R5.2 R7.1 R14.2 R15.2 SW1.1 SW2.1 U1.2(GND) U2.1(GND) U2.2(GND) U2.11(GND) U2.14(GND) U2.36(GND) U2.37(GND) U2.38(GND) U2.39(GND) U2.40(GND) U2.41(GND) U2.42(GND) U2.43(GND) U2.44(GND) U2.45(GND) U2.46(GND) U2.47(GND) U2.48(GND) U2.49(GND) U2.50(GND) U2.51(GND) U2.52(GND) U2.53(GND) U3.1(REF) U3.2(GND) U3.5(IN-) U4.2(PGND) U4.4(ISENS-) U4.9(ADD) U4.16(AGND) U5.1(REF) U5.2(GND) U5.5(IN-) USB1.1(GND) USB1.12(GND)
VCC: C4.2 C6.2 C7.1 L1.2 L2.1 R6.2 R8.2 R9.2 R10.2 R11.1 R12.1 U2.3(3V3)
ADC_50MA: U2.5(IO2) U5.6(OUT)
ADC_500MA: U2.6(IO3) U3.6(OUT)
BOOT: C9.1 D3.1(K) D3.2(K) R12.2 SW2.2 U2.23(IO9)
DN: D1.6(IO1) U2.17(IO12)
DP: D1.4(IO2) U2.18(IO13)
EN: C5.1 C8.1 D2.1(K) D2.2(K) R8.1 SW1.2 U2.8(EN)
LED: LED6.4(DIN) U2.25(IO19)
MP_EN: U2.27(IO21) U4.20(EN)
MP_OUT: C13.1 C14.1 C15.1 P1.1 R13.1 U4.3(OUT)
SCL: R9.1 U2.19(IO14) U4.7(SCL)
SDA: R10.1 U2.20(IO15) U4.6(SDA)
VUSB: F1.1 USB1.2(VBUS) USB1.11(VBUS)
$6N313: C3.1 R5.1 USB1.13(SHELL) USB1.14(SHELL)
$6N583: R1.1 USB1.10(CC2)
$6N609: R3.1 USB1.4(CC1)
$6N676: R2.1 USB1.6(DP1) USB1.8(DP2)
$6N682: R4.1 USB1.5(DN2) USB1.7(DN1)
$6N1784: D1.1(IO1) R4.2
$6N1787: D1.3(IO2) R2.2
$7N377: R6.1 R7.2 U1.6(FB)
$7N506: L1.1 U1.3(SW)
$8N827: R11.2 U2.22(IO8)
$8N2221: LED5.4(DIN) LED6.2(DOUT)
$8N2227: LED4.4(DIN) LED5.2(DOUT)
$8N2234: LED3.4(DIN) LED4.2(DOUT)
$8N2241: LED2.4(DIN) LED3.2(DOUT)
$8N2248: LED1.4(DIN) LED2.2(DOUT)
$9N688: C19.2 U4.14(BST1)
$9N714: C21.2 U4.11(BST2)
$9N742: C19.1 L3.2 U4.13(SW1)
$9N747: C21.1 L3.1 U4.12(SW2)
$9N778: C20.2 U4.15(VCC)
$9N877: R13.2 R14.1 U4.21(FB)
$9N2307: C11.2 C18.2 L2.2 U3.3(V+) U5.3(V+)

Not connected (* = marked no-connect by the designer): LED1 2(DOUT); U1 5(PG); U2 4(NC) 7(NC) 9(IO4) 10(IO5) 12(IO0) 13(IO1) 15(IO6) 16(IO7) 21(NC) 24(IO18) 26(IO20) 28(IO22) 29(IO23) 30(RXD0) 31(TXD0) 32(NC) 33(NC) 34(NC) 35(NC); U4 8(ALT) 10(GATE) 18(DRV) 19(SYNCI); USB1 3(SBU2) 9(SBU1)

## Notes on the sheets
sheet 1
- USB
- ESP32
- MP4245
- OUT
- INA214

# Board PCB
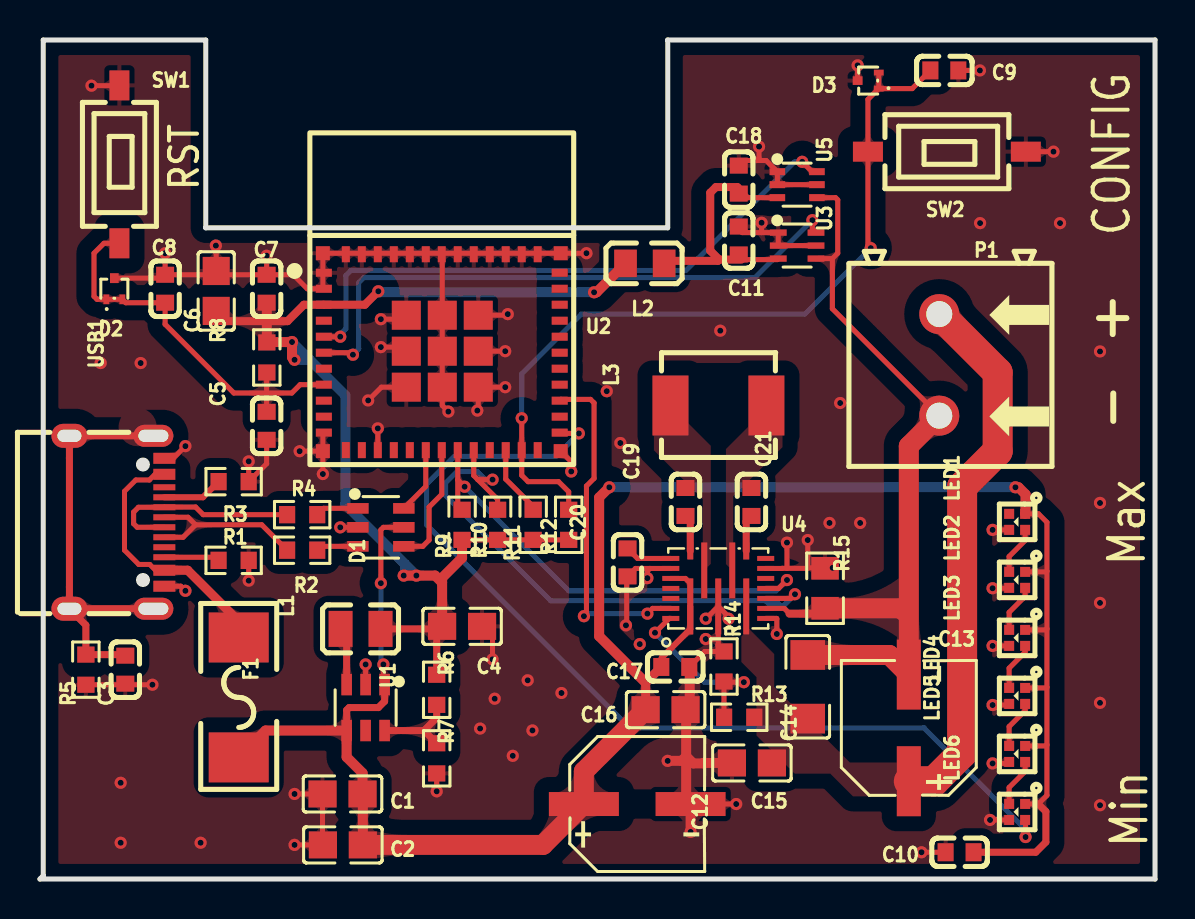
[diagram p5: board, top side]
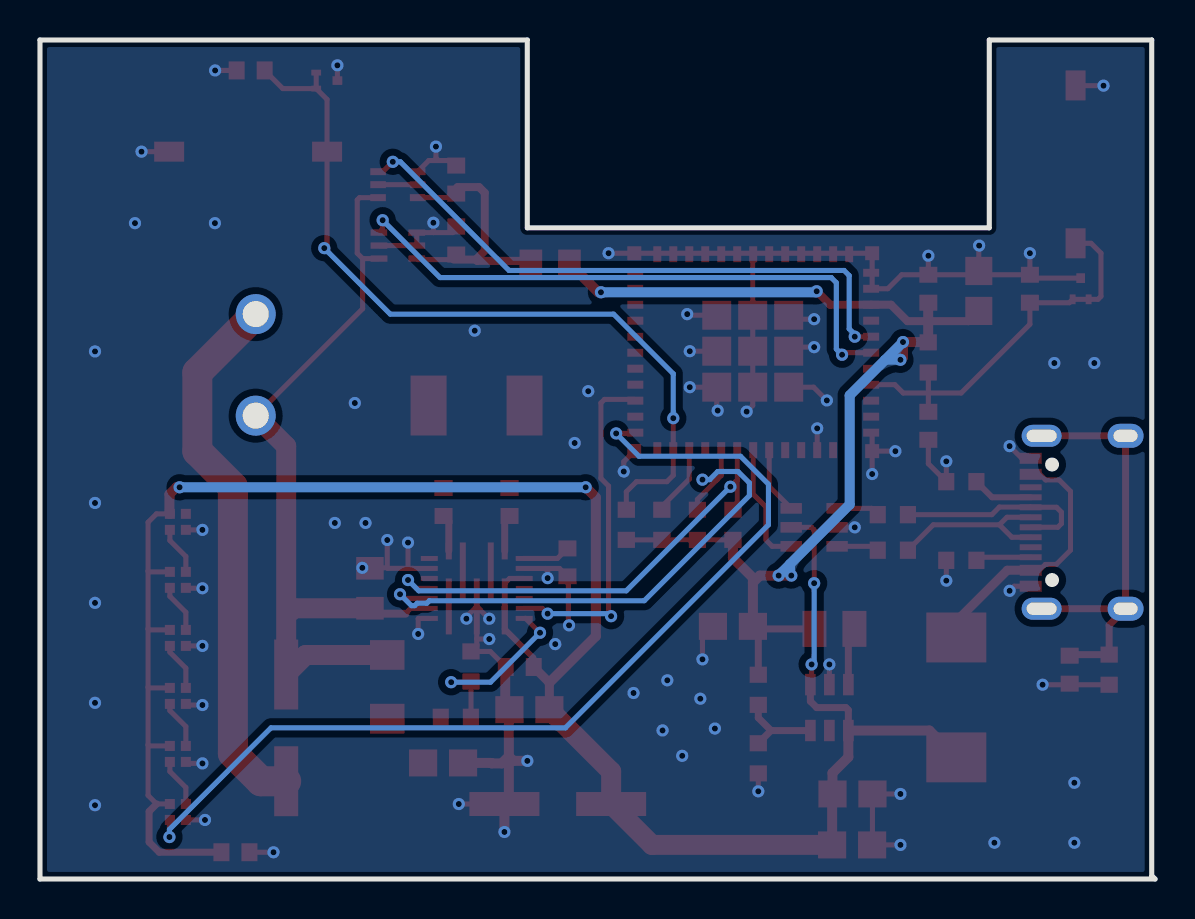
[diagram p6: board, bottom side, seen from below]

Outline 55.79 x 41.98 mm; copper layers: Top Layer, Bottom Layer. Coordinates in mm from the lower left corner of the outline.
Outline path: 0,0 55.79,0 55.79,41.98 31.41,41.98 31.41,32.58 8.29,32.58 8.29,41.98 0.16,41.98 0.16,0.16 0,0
Stack: Top Layer 0.035mm / Dielectric1 1.51mm FR4 er 4.5 / Bottom Layer 0.035mm

## Design rules (mm)
template: Custom Config
spacing copperThickness1oz (default): track to track 0.102, other pairs 0.152 to 0.3
spacing copperThickness2oz: track to track 0.203, other pairs 0.152 to 0.3
track width copperThickness1oz (default): min 0.127, default 0.254, max 2.54
track width copperThickness2oz: min 0.203, default 0.254, max 2.54
differential pair differentialPair (default): width min 0.127, default 0.254, max 2.54; gap min 0.152, default 0.152
via viaSize (default): diameter min 0.5, default 0.61, max 10; hole min 0.3, default 0.305, max 6.3
net GND uses BOTTOM
net $9N742 uses SOLID

## Placement (name value [footprint] x y rotation side)
C1  22uF  [C0805]  15.14 4.26 0 top
C2  22uF  [C0805]  15.16 1.71 0 top
C3  100nF  [C0603]  4.27 10.47 270 top
C4  22uF  [C0805]  21.12 12.64 180 top
C5  1uF  [C0603]  11.34 22.67 270 top
C6  22uF  [C0805]  8.82 29.42 270 top
C7  100nF  [C0603]  11.34 29.53 90 top
C8  100nF  [C0603]  6.26 29.53 90 top
C9  100nF  [C0603]  45.25 40.45 0 top
C10  100nF  [C0603]  46.01 1.34 180 top
C11  100nF  [C0603]  34.96 31.95 270 top
C12  100uF  [CAP-SMD_BD6.3-L6.6-W6.6-FD]  29.88 3.75 0 top
C13  100uF  [CAP-SMD_BD6.3-L6.6-W6.6-FD]  43.47 7.56 90 top
C14  22uF  [C1206]  38.42 9.62 90 top
C15  10uF  [C0805]  35.62 5.81 180 top
C16  10uF  [C0805]  31.3 8.47 0 top
C17  100nF  [C0603]  31.79 10.61 180 top
C18  100nF  [C0603]  34.96 34.99 270 top
C19  220nF  [C0603]  32.3 18.86 270 top
C20  1uF  [C0603]  29.4 15.84 90 top
C21  220nF  [C0603]  35.6 18.86 270 top
D1  USBLC6-2SC6  [SOT-23-6_L2.9-W1.6-P0.95-LS2.8-BL]  17.06 17.59 270 top
D2  ESD7C3.3DT5G-MS  [SOT-723-3_L1.2-W0.8-P0.80-LS1.2-BR]  3.72 29.53 270 top
D3  ESD7C3.3DT5G-MS  [SOT-723-3_L1.2-W0.8-P0.80-LS1.2-BR]  41.44 39.95 0 top
F1  SCF6125F2A250V  [FUSE-SMD_L6.3-W2.7]  9.94 9.09 270 top
L1  1uH  [L0806]  16.04 12.52 0 top
L2  100uH  [L0805]  30.26 30.8 0 top
L3  4.7uH  [IND-SMD_L5.7-W5.2_CYA0530]  33.95 23.69 180 top
LED1  WS2812E-1313  [LED-SMD_4P-L1.3-W1.3-P0.80_WS2812E-1313]  48.89 17.87 270 top
LED2  WS2812E-1313  [LED-SMD_4P-L1.3-W1.3-P0.80_WS2812E-1313]  48.89 14.97 270 top
LED3  WS2812E-1313  [LED-SMD_4P-L1.3-W1.3-P0.80_WS2812E-1313]  48.89 12.06 270 top
LED4  WS2812E-1313  [LED-SMD_4P-L1.3-W1.3-P0.80_WS2812E-1313]  48.89 9.16 270 top
LED5  WS2812E-1313  [LED-SMD_4P-L1.3-W1.3-P0.80_WS2812E-1313]  48.89 6.26 270 top
LED6  WS2812E-1313  [LED-SMD_4P-L1.3-W1.3-P0.80_WS2812E-1313]  48.89 3.36 270 top
P1  WJ500V-5.08-2P  [CONN-TH_2P-P5.00_WJ500V-5.08-2P]  45 25.72 270 top
R1  5.1kΩ  [R0603]  9.69 15.94 0 top
R2  10Ω  [R0603]  13.12 16.45 0 top
R3  5.1kΩ  [R0603]  9.69 19.88 0 top
R4  10Ω  [R0603]  13.12 18.23 0 top
R5  10kΩ  [R0603]  2.3 10.47 270 top
R6  453kΩ  [R0603]  19.85 9.47 90 top
R7  100kΩ  [R0603]  19.85 6.04 90 top
R8  10kΩ  [R0603]  11.35 26.1 90 top
R9  2.2kΩ  [R0603]  21.12 17.72 270 top
R10  2.2kΩ  [R0603]  22.9 17.72 270 top
R11  10kΩ  [R0603]  24.68 17.72 90 top
R12  10kΩ  [R0603]  26.45 17.72 90 top
R13  90.9kΩ  [R0603]  34.99 8.09 180 top
R14  6.2kΩ  [R0603]  34.22 10.63 90 top
R15  20mΩ  [R0805]  39.28 14.55 90 top
SW1  TS-1007S-AR02516  [SW-SMD_L6.1-W3.6-LS7.9]  3.97 35.76 270 top
SW2  TS-1007S-AR02516  [SW-SMD_L6.1-W3.6-LS7.9]  45.38 36.39 180 top
U1  TPS62A02PDDCR  [SOT-23-6_L2.9-W1.6-P0.95-LS2.9-BL]  16.29 8.58 180 top
U2  ESP32-C6-MINI-1-N4  [WIFIM-SMD_61P-L16.6-W13.2-P0.80-ESP32-C6-MINI-1-N4]  20.1 26.36 0 top
U3  INA214AIDCKR  [SC-70-6_L2.2-W1.3-P0.65-LS2.2-BR]  37.88 31.69 180 top
U4  MP4245GVE-0000-Z  [QFN-21_L5.0-W4.0_MP4245GVE]  33.94 14.73 90 top
U5  INA212AIDCKR  [SOT-363_L2.0-W1.3-P0.65-LS2.1-BL]  37.88 34.74 270 top
USB1  TYPE-C 16PIN 2MD(073)  [USB-C-SMD_TYPE-C-6PIN-2MD-073]  3.85 17.85 270 top

## Footprints (pads in the part's own frame, mm; a bottom-side part is the same pattern mirrored in y, then rotated)
C0603
  rect 0.8x0.9 smd: 1(-0.7,0) 2(0.7,0)
C0805
  rect 1.41x1.35 smd: 1(-1,0) 2(1,0)
C1206
  rect 1.485x1.728 smd: 1(-1.593,0) 2(1.593,0)
CAP-SMD_BD6.3-L6.6-W6.6-FD
  rect 3.5x1.2 smd: 1(-2.67,0) 2(2.67,0)
CONN-TH_2P-P5.00_WJ500V-5.08-2P
  round 2 hole 1.3: 1(-2.54,0) 2(2.54,0)
FUSE-SMD_L6.3-W2.7
  rect 2.5x3 smd: 1(-3,0) 2(3,0)
IND-SMD_L5.7-W5.2_CYA0530
  rect 1.8x3 smd: 1(-2.4,0) 2(2.4,0)
L0805
  rect 1.133x1.377 smd: 1(-0.966,0) 2(0.966,0)
L0806
  rect 1.2x1.8 smd: 1(-1,0) 2(1,0)
LED-SMD_4P-L1.3-W1.3-P0.80_WS2812E-1313
  rect 0.5x0.5 smd: 1(-0.4,0.4) 2(-0.4,-0.4) 3(0.4,-0.4) 4(0.4,0.4)
QFN-21_L5.0-W4.0_MP4245GVE
  rect 2.8x0.3 smd: 1(-1.087,1.4) 2(-1.087,0) 3(-1.087,-1.4) 12(0.713,-0.7) 13(0.713,0.7)
  rect 0.25x0.85 smd: 4(-1.688,-2.373) 5(-1.188,-2.375) 6(-0.688,-2.375) 7(-0.188,-2.375) 8(0.312,-2.375) 9(0.812,-2.375) 10(1.312,-2.375) 15(1.312,2.375) 16(0.812,2.375) 17(0.312,2.375) 18(-0.188,2.375) 19(-0.688,2.375) 20(-1.188,2.375) 21(-1.688,2.375)
  rect 0.85x0.3 smd: 11(1.688,-1.4) 14(1.688,1.4)
R0603
  rect 0.806x0.864 smd: 1(-0.753,0) 2(0.753,0)
R0805
  rect 1.133x1.377 smd: 1(-1,0) 2(1,0)
SC-70-6_L2.2-W1.3-P0.65-LS2.2-BR
  rect 0.841x0.315 smd: 1(0.946,-0.65) 2(0.946,0) 3(0.946,0.65) 4(-0.946,0.65) 5(-0.946,0) 6(-0.946,-0.65)
SOT-23-6_L2.9-W1.6-P0.95-LS2.8-BL
  rect 0.532x1.072 smd: 1(-0.95,-1.149) 2(0,-1.149) 3(0.95,-1.149) 4(0.95,1.149) 5(0,1.149) 6(-0.95,1.149)
SOT-23-6_L2.9-W1.6-P0.95-LS2.9-BL
  rect 0.532x1.072 smd: 1(-0.95,-1.149) 2(0,-1.149) 3(0.95,-1.149) 4(0.95,1.149) 5(0,1.149) 6(-0.95,1.149)
SOT-363_L2.0-W1.3-P0.65-LS2.1-BL
  rect 0.35x0.78 smd: 1(-0.65,-0.99) 2(0,-0.99) 3(0.65,-0.99) 4(0.65,0.99) 5(0,0.99) 6(-0.65,0.99)
SOT-723-3_L1.2-W0.8-P0.80-LS1.2-BR
  rect 0.489x0.294 smd: 1(0.529,-0.4) 2(0.529,0.4)
  rect 0.489x0.434 smd: 3(-0.529,0)
SW-SMD_L6.1-W3.6-LS7.9
  rect 1.5x1 smd: 1(-3.95,0) 2(3.95,0)
USB-C-SMD_TYPE-C-6PIN-2MD-073
  rect 0.55x1.1 smd: 1(-3.2,2.375) 2(-2.4,2.375) 11(2.4,2.375) 12(3.2,2.375)
  rect 0.3x1.1 smd: 3(-1.75,2.375) 4(-1.25,2.375) 5(-0.75,2.375) 6(-0.25,2.375) 7(0.25,2.375) 8(0.75,2.375) 9(1.25,2.375) 10(1.75,2.375)
  oval 1.1x2 hole 0.6x1.5: 13(-4.325,1.825) 14(4.325,1.825)
  oval 1.2x1.8 hole 0.6x1.2: 13(-4.325,-2.375) 14(4.325,-2.375)
WIFIM-SMD_61P-L16.6-W13.2-P0.80-ESP32-C6-MINI-1-N4
  rect 0.8x0.4 smd: 1(-5.9,3.975) 2(-5.9,3.175) 3(-5.9,2.375) 4(-5.9,1.575) 5(-5.9,0.775) 6(-5.9,-0.025) 7(-5.9,-0.825) 8(-5.9,-1.625) 9(-5.9,-2.425) 10(-5.9,-3.225) 11(-5.9,-4.025) 25(5.9,-4.025) 26(5.9,-3.225) 27(5.9,-2.425) 28(5.9,-1.625) 29(5.9,-0.825) 30(5.9,-0.025) 31(5.9,0.775) 32(5.9,1.575) 33(5.9,2.375) 34(5.9,3.175) 35(5.9,3.975)
  rect 0.4x0.8 smd: 12(-4.8,-4.9) 13(-4,-4.9) 14(-3.2,-4.9) 15(-2.4,-4.9) 16(-1.6,-4.9) 17(-0.8,-4.9) 18(0,-4.9) 19(0.8,-4.9) 20(1.6,-4.9) 21(2.4,-4.9) 22(3.2,-4.9) 23(4,-4.9) 24(4.8,-4.9) 36(4.8,4.9) 37(4,4.9) 38(3.2,4.9) 39(2.4,4.9) 40(1.6,4.9) 41(0.8,4.9) 42(0,4.9) 43(-0.8,4.9) 44(-1.6,4.9) 45(-2.4,4.9) 46(-3.2,4.9) 47(-4,4.9) 48(-4.8,4.9)
  rect 1.45x1.45 smd: 49(-1.775,1.85) 49(-1.775,0.05) 49(-1.775,-1.75) 49(0.025,1.85) 49(0.025,0.05) 49(0.025,-1.75) 49(1.825,1.85) 49(1.825,0.05) 49(1.825,-1.75)
  rect 0.7x0.7 smd: 50(5.95,4.95) 51(5.95,-4.95) 52(-5.95,-4.95) 53(-5.95,4.95)

## Nets
As in the schematic.

Pads without a net: LED1 2; U1 5; U2 4 7 9 10 12 13 15 16 21 24 26 28 29 30 31 32 33 34 35; U4 8 10 18 19; USB1 3 9

## Via types
v1: diameter 0.61, hole 0.305, Top Layer to Bottom Layer, 103 vias

## Routing (per net, layer and track width the routed paths; a pad name or vN(x,y) marks a point on that pad's centre or on a via; arc(x,y) is an arc through that point)
+5V: length 110.6
  Top Layer w0.254: 50.38,9.59 50.35,9.56 LED4.1 ; 50.38,9.59 50.38,6.72 ; 50.38,9.59 50.38,12.52 ; 50.38,6.72 50.38,4.19 49.95,3.76 LED6.1 ; 50.38,6.72 50.33,6.66 LED5.1 ; 50.38,15.4 50.38,12.52 ; 50.38,15.4 50.38,17.85 49.96,18.27 49.29,18.27 ; 50.38,15.4 50.35,15.37 LED2.1 ; 50.38,12.52 50.33,12.46 LED3.1 ; v1(17.06,14.8) 17.06,17.47 17.18,17.59 D1.5 ; U4.1 32.54,14.79 32.29,15.04 U4.17 ; v1(17.18,10.74) 17.18,9.79 U1.1
  Top Layer w0.3: U4.1 32.54,12.5 31.11,11.08 31.11,10.63
  Top Layer w0.35: C10.1 49.82,1.34 50.33,1.85 50.33,3.38 49.95,3.76 ; U1.1 17.24,8.89 16.93,8.58 15.47,8.58 15.34,8.45 U1.4
  Top Layer w0.45: C16.1 30.3,9.83 31.11,10.63
  Top Layer w0.5: 49.29,18.27 49.31,18.29 49.31,19.25 48.96,19.6 v1(48.81,19.6) ; v1(28.49,19.6) 27.98,19.09 27.98,12.15 30.3,9.83 ; C2.2 16.16,4.24 C1.2 16.14,5.3 15.34,6.1 U1.4 11.29,7.43 F1.2
  Top Layer w1: C2.2 25.17,1.71 C12.1 27.21,5.38 C16.1
  Bottom Layer w0.254: v1(17.06,14.8) 17.06,10.86 v1(17.18,10.74)
  Bottom Layer w0.5: v1(48.81,19.6) v1(28.49,19.6)
AGND: length 41.3
  Top Layer w0.254: 37.5,13.28 37.24,13.54 U4.5 ; P1.2 39.65,28.53 39.65,31.04 ; 38.87,34.09 39.8,34.09 39.92,33.98 39.92,31.31 39.65,31.04 ; 39.65,31.04 38.83,31.04
  Top Layer w0.4: 37.5,13.28 39.01,13.28 R15.1
  Top Layer w1: 43.22,13.4 43.08,13.55 R15.1 ; C14.2 42.49,11.21 C13.2 43.47,21.66 P1.2
GND: length 128.5
  Top Layer w0.254: U2.49 17.08,24.61 v1(16.42,23.94) ; U2.52 v1(14.15,20.26) ; U2.52 14.15,22.28 U2.11 ; U2.52 12.99,21.41 v1(12.99,21.41) ; C7.2 C8.2 ; C7.2 v1(11.34,31.18) ; C7.2 12.67,30.23 13.37,29.53 U2.2 14.15,29.58 14.15,31.31 27.34,31.31 v1(27.34,31.31) ; C8.2 v1(6.26,31.31) ; C8.2 6.09,30.06 D2.3 ; v1(20.43,23.39) 20.13,23.69 U2.49 U2.49 U2.49 20.13,31.23 U2.42 ; v1(2.58,39.69) 3.96,39.69 SW1.1 ; 36.11,32.34 35.14,32.34 35.09,32.39 ; 36.11,32.34 U3.1 U3.2 U3.5 ; 36.11,32.34 v1(36.11,32.83) ; 37.38,15.54 38.39,15.54 38.42,15.57 ; 37.38,15.54 v1(37.38,16.83) ; 37.38,15.54 37.13,15.54 37.13,15.54 U4.9 ; LED3.3 v1(47.66,11.66) ; U2.51 26.58,20.88 v1(26.58,20.39) ; 33.94,12.02 33.92,12.01 v1(33.31,12.01) ; 33.94,12.02 U4.2 ; 33.94,12.02 33.94,11.67 R14.2 33.26,11.39 32.51,10.63 ; v1(23.28,24.61) U2.49 21.93,23.48 v1(21.88,23.44) ; v1(30.39,15.05) 30.39,15.41 30.52,15.54 ; LED5.3 48.42,5.78 v1(47.66,5.78) ; v1(12.74,1.71) C2.1 14.14,1.72 C1.1 v1(12.74,4.26) ; v1(47.66,14.55) 48.47,14.55 LED2.3 ; v1(35.98,36.64) 35.98,36.08 35.85,35.95 ; v1(17.06,26.61) 18.12,26.61 U2.49 ; 35.85,35.95 34.96,35.95 ; 35.85,35.95 36.34,35.95 U5.1 U5.2 U5.5 ; U2.49 v1(23.28,26.41) ; 48.49,17.47 v1(47.66,17.47) ; R7.1 v1(19.85,4.39) ; v1(5.63,9.72) 4.32,9.72 C3.2 4.22,9.72 R5.2 ; v1(7.28,21.66) 6.67,21.05 USB1.1 ; C5.2 11.34,20.78 R3.2 v1(10.44,20.9) ; v1(33.31,13.02) 33.32,13.02 U4.2 ; v1(22.64,10.99) 22.64,12.12 C4.1 ; U2.49 23.35,28.21 v1(23.41,28.26) ; 30.52,15.54 29.8,15.54 C20.1 29.36,15.1 29.36,12.73 v1(29.32,12.69) ; 30.52,15.54 U4.16 ; U4.2 34.45,13.12 v1(34.45,13.02) ; v1(7.28,14.42) 7.05,14.65 USB1.12 ; C10.2 v1(44.11,1.34) ; 38.42,15.57 v1(39.66,15.57) ; 38.42,15.57 v1(38.42,16.96) ; U4.4 36.85,13.04 36.87,13.02 v1(36.87,12.26) ; v1(47.66,8.7) 48.43,8.7 LED4.3 ; U2.14 v1(16.9,22.55) ; LED6.3 v1(47.54,2.96) ; SW2.1 v1(50.71,36.39) ; D1.2 v1(15.02,17.59) ; v1(17.06,28.01) 18.13,28.01 U2.49 ; C9.2 v1(47.03,40.45) ; D3.3 v1(40.91,40.71) ; C6.1 8.82,31.68 v1(8.8,31.69) ; R1.2 v1(10.44,14.93) ; C12.2 v1(34.84,3.75) ; U1.2 v1(16.29,10.74)
  Top Layer w0.5: C15.2 33.21,5.81 33.18,5.78 32.68,5.78 32.33,6.14 ; v1(31.41,5.91) 32.11,5.91 32.33,6.14 ; 32.33,6.14 32.33,8.44 C16.2 32.51,8.68 32.51,10.63 ; 32.33,6.14 32.33,3.97 C12.2 v1(32.55,2.36)
  vias: v1(3.04,25.81) v1(4.04,4.81) v1(4.04,1.81) v1(5.04,25.81) v1(8.04,1.81) v1(22.02,7.53) v1(22.75,9.02) v1(23.66,6.16) v1(24.4,9.94) v1(24.64,7.43) v1(26.09,9.31) v1(28.36,24.41) v1(29.04,21.81) v1(30.01,11.75) v1(34.04,27.43) v1(39.5,17.81) v1(40.04,23.81) v1(41.04,17.81) v1(47.04,32.81) v1(51.04,32.81) v1(53.04,26.4) v1(53.04,18.81) v1(53.04,13.81) v1(53.04,8.81) v1(53.04,3.69)
VCC: length 59.2
  Top Layer w0.254: R9.2 R10.2 R11.1 R12.1
  Top Layer w0.35: L1.2 19.99,12.52 19.85,12.37 R6.2
  Top Layer w0.4: C6.2 9.33,27.91 12.39,27.91 13.21,28.73 U2.3 16.26,28.73 v1(16.93,29.41)
  Top Layer w0.5: v1(27.72,29.36) 27.85,29.36 L2.1 ; v1(12.74,25.98) 12.61,26.1 v1(12.61,26.87) 11.37,26.87 R8.2 11.35,28.82 C7.1 ; 20.12,14.83 19.77,15.18 v1(18.83,15.18) v1(18.2,15.18) ; 20.12,14.83 20.12,15.07 21.12,16.07 R9.2 ; 20.12,14.83 C4.2
  Bottom Layer w0.5: 13.5,25.98 15.28,24.2 15.28,18.74 18.26,15.75 ; 13.5,25.98 v1(12.61,26.87) ; 13.5,25.98 v1(12.74,25.98) ; v1(27.72,29.36) 16.98,29.36 v1(16.93,29.41) ; 18.26,15.75 v1(18.83,15.18) ; 18.26,15.75 18.26,15.25 v1(18.2,15.18)
ADC_50MA: length 30.1
  Top Layer w0.254: U5.6 38.63,35.39 v1(38.14,35.88) ; U2.5 v1(15.02,27.13)
  Bottom Layer w0.254: v1(15.02,27.13) 15.02,27.25 15.3,27.53 15.3,30.19 15.56,30.45 32.32,30.45 37.76,35.88 v1(38.14,35.88)
ADC_500MA: length 29.9
  Top Layer w0.254: v1(15.66,26.23) 15.56,26.33 U2.6 ; U3.6 38.65,32.53 v1(38.65,32.96)
  Bottom Layer w0.254: v1(15.66,26.23) 15.95,26.52 15.95,29.84 16.2,30.09 35.78,30.09 v1(38.65,32.96)
BOOT: length 40.8
  Top Layer w0.254: D3.1 41.43,39 SW2.2 41.43,31.7 v1(41.57,31.56) ; D3.1 43.64,39.55 C9.1 ; D3.1 D3.2 ; v1(24.1,23.06) U2.23 24.1,20.2 24.42,19.88 25.95,19.88 26.45,19.37 R12.2
  Bottom Layer w0.254: v1(24.1,23.06) 24.1,25.28 27.09,28.26 38.27,28.26 v1(41.57,31.56)
DN: length 3.4
  Top Layer w0.254: D1.6 19.3,19.64 U2.17
DP: length 6.2
  Top Layer w0.254: U2.18 20.1,19.25 19.47,18.61 19.47,16.96 19.15,16.64 D1.4
EN: length 19.9
  Top Layer w0.254: C5.1 11.34,24.32 ; 11.34,24.32 9.7,24.32 6.26,27.75 C8.1 4.29,28.83 D2.2 D2.1 2.85,29 2.7,29.15 2.7,31.31 3.2,31.81 SW1.2 ; 11.34,24.32 12.6,24.32 13.02,24.73 U2.8 ; 11.34,24.32 11.34,25.33 R8.1
LED: length 49.2
  Top Layer w0.254: v1(26.96,22.29) 26.04,22.29 U2.25 ; LED6.4 49.31,2.93 v1(49.31,2.1)
  Bottom Layer w0.254: v1(49.31,2.1) 49.31,2.48 44.23,7.56 29.5,7.56 19.34,17.72 19.34,19.75 20.74,21.15 25.82,21.15 v1(26.96,22.29)
MP_EN: length 17.2
  Top Layer w0.254: v1(30.39,13.28) 30.65,13.54 31.07,13.54 31.07,13.54 U4.20 ; v1(27.22,13.15) 27.34,13.28 27.34,19.66 27.72,20.04 27.72,23.82 27.54,24 26.07,24 U2.27
  Bottom Layer w0.254: v1(30.39,13.28) 27.34,13.28 v1(27.22,13.15)
MP_OUT: length 27.2
  Top Layer w1.5: P1.1 47.92,25.34 47.92,21.41 46.14,19.63 46.14,6.29 44.74,4.89 C13.1
SCL: length 23.3
  Top Layer w0.254: U4.7 36.96,14.54 v1(37.38,14.96) ; v1(21.25,19.63) 20.9,19.97 ; 20.9,19.97 20.9,18.69 R9.1 ; 20.9,19.97 U2.19
  Bottom Layer w0.254: v1(21.25,19.63) 26.45,14.42 36.84,14.42 v1(37.38,14.96)
SDA: length 29.2
  Top Layer w0.254: 21.91,19.98 21.7,20.19 U2.20 ; 21.91,19.98 v1(22.64,19.98) ; 21.91,19.98 22.9,18.99 R10.1 ; U4.6 37.57,14.04 v1(37.78,14.25)
  Bottom Layer w0.254: v1(22.64,19.98) 22.29,19.98 21.88,20.39 20.87,20.39 20.29,19.82 20.29,19.18 25.55,13.92 36.31,13.92 36.44,13.8 36.92,13.8 37.04,13.68 37.2,13.68 v1(37.78,14.25)
VUSB: length 13.3
  Top Layer w0.25: USB1.11 6.21,15.44 5.79,15.44 5.49,15.74 4.94,15.74 4.23,16.45 4.23,19.4 4.79,19.96 5.47,19.96 5.76,20.25 USB1.2
  Top Layer w0.45: USB1.11 7.39,15.45 9.94,12.9 F1.1
$6N313: length 21.7
  Top Layer w0.35: USB1.14 USB1.14 ; USB1.14 2.3,12.7 R5.1 4.22,11.23 C3.1 ; USB1.14 USB1.13 USB1.13
$6N583: length 2.8
  Top Layer w0.254: R1.1 8.78,16.1 USB1.10
$6N609: length 3
  Top Layer w0.3: R3.1 8.15,19.1 USB1.4
$6N676: length 8.6
  Top Layer w0.254: USB1.8 7.16,17.1 7.78,17.72 ; 7.78,17.72 7.41,18.1 USB1.6 ; 7.78,17.72 11.1,17.72 R2.1
$6N682: length 10.1
  Top Layer w0.254: R4.1 8.17,18.23 7.78,18.61 6.23,18.61 USB1.5 4.93,18.6 4.68,18.36 4.68,17.78 4.86,17.6 USB1.7
$6N1784: length 2.2
  Top Layer w0.254: R4.2 14.19,18.55 D1.1
$6N1787: length 2.1
  Top Layer w0.254: D1.3 14.07,16.64 R2.2
$7N377: length 4.4
  Top Layer w0.35: 19.21,7.43 19.85,8.07 R6.1 ; 19.21,7.43 U1.6 ; 19.21,7.43 R7.2
$7N506: length 2.9
  Top Layer w0.35: L1.1 15.34,12.21 U1.3
$8N827: length 3.6
  Top Layer w0.254: R11.2 24.68,18.64 23.3,20.01 U2.22
$8N2221: length 2.4
  Top Layer w0.254: LED6.2 48.49,4.58 49.29,5.38 LED5.4
$8N2227: length 2.4
  Top Layer w0.254: LED5.2 48.49,7.63 49.29,8.43 LED4.4
$8N2234: length 2.4
  Top Layer w0.254: LED3.4 49.29,11.35 48.49,10.55 LED4.2
$8N2241: length 2.4
  Top Layer w0.254: LED3.2 48.49,13.34 49.29,14.14 LED2.4
$8N2248: length 2.4
  Top Layer w0.254: LED2.2 48.49,16.14 49.29,16.94 LED1.4
$9N688: length 1.9
  Top Layer w0.35: U4.14 32.54,17.92 C19.2
$9N714: length 1.9
  Top Layer w0.35: C21.2 35.34,17.9 U4.11
$9N778: length 2.4
  Top Layer w0.254: U4.15 29.9,16.04 29.4,16.54
$9N877: length 9.4
  Top Layer w0.254: U4.21 31.49,13.04 v1(30.77,12.32) ; v1(35.22,9.85) 34.26,9.85 R14.1 34.22,8.1 R13.2
  Bottom Layer w0.254: v1(30.77,12.32) 33.25,9.85 v1(35.22,9.85)
$9N2307: length 13
  Top Layer w0.254: 35.09,30.99 36.89,30.99 36.94,31.04 ; 34.96,34.55 35.42,34.09 36.89,34.09
  Top Layer w0.4: L2.2 31.35,30.93 33.92,30.93 33.98,30.99 ; 34.96,34.55 34.89,34.62 33.82,34.62 33.54,34.34 33.54,31.44 33.98,30.99 ; 35.09,30.99 33.98,30.99

## Copper pours and planes (outline as drawn; the poured copper is in the pictures)
GND on Top Layer: 0.16,41.98 55.79,41.98 55.79,0 0.16,0
GND on Bottom Layer: -0.09,42.11 55.54,42.11 55.54,-0.06 -0.09,-0.06
MP_OUT on Top Layer: 35.09,12.66 43.47,12.66 43.47,4.13 35.09,4.13
$9N742 on Top Layer: 30.72,23.69 33.57,23.69 33.57,15.44 30.72,15.44
$9N747 on Top Layer: 34.32,23.5 37.15,23.5 37.15,15.44 34.32,15.44

Small or netless copper shapes (teardrops, artwork), in the pictures only: 280 on Top Layer, 16 on Bottom Layer

## Text on the board
Top Silkscreen Layer: RST | CONFIG | Max | Min | + | -
